# Altium schematic sheet main.SchDoc
size A4; PageSetup: Record=PageOptions|CenterHorizontal=True|CenterVertical=True|PrintScale=0.97|XCorrection=1.00|YCorrection=1.00|PrintKind=0|BorderSize=5000000|LeftOffset=0|BottomOffset=0|Orientation=2|PaperLength=1000|PaperWidth=1000|Scale=100|PaperSource=273|PrintQuality=-2|MediaType=1|DitherType=10|PaperKind=A4|PrintScaleMode=1; Organization: Altium Limited; Address1: 3 Minna Close; Address2: Belrose; Address3: NSW 2085; Address4: Australia
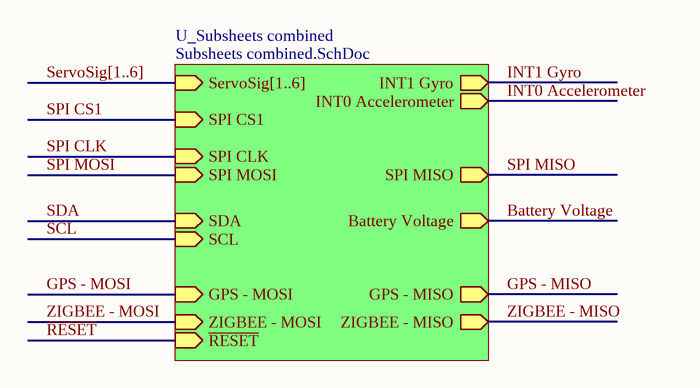
[diagram p0: main.SchDoc]

## Sub-sheets
U_Subsheets combined = Subsheets combined.SchDoc: ServoSig[1..6] (in), INT0 Accelerometer (out), INT1 Gyro (out), ZIGBEE - MISO (out), ZIGBEE - MOSI (in), ~{RESET} (in), SPI CS1 (in), SPI CLK (in), SPI MOSI (in), SPI MISO (out), SDA (in), SCL (in), Battery Voltage (out), GPS - MISO (out), GPS - MOSI (in)

## Nets
Battery Voltage: sheet U_Subsheets combined/Battery Voltage
GPS - MISO: sheet U_Subsheets combined/GPS - MISO
GPS - MOSI: sheet U_Subsheets combined/GPS - MOSI
INT0 Accelerometer: sheet U_Subsheets combined/INT0 Accelerometer
INT1 Gyro: sheet U_Subsheets combined/INT1 Gyro
~{RESET}: sheet U_Subsheets combined/~{RESET}
SCL: sheet U_Subsheets combined/SCL
SDA: sheet U_Subsheets combined/SDA
SPI CLK: sheet U_Subsheets combined/SPI CLK
SPI CS1: sheet U_Subsheets combined/SPI CS1
SPI MISO: sheet U_Subsheets combined/SPI MISO
SPI MOSI: sheet U_Subsheets combined/SPI MOSI
ZIGBEE - MISO: sheet U_Subsheets combined/ZIGBEE - MISO
ZIGBEE - MOSI: sheet U_Subsheets combined/ZIGBEE - MOSI

## Buses and harness runs
bus ServoSig[1..6] = sheet U_Subsheets combined/ServoSig[1..6]

## Notes on the sheet
- Disclaimer
  Any design and information, hardware or software  is provided on an "as-is" basis without warranty of any kind and any express or implied warranties, including, but not limited to, the implied warranties of merchantability and fitness for a particular purpose are disclaimed. In no event shall wnpd (or KeaDrone)be liable for any direct, indirect, incidental, special, exemplary, or consequential damages (including, but not limited to, procurement of substitute goods or services; loss of use, data, or profits; or business interruption) however caused and on any theory of liability, whether in contract, strict liability, or tort (including negligence or otherwise) arising in any way out of the use of this firmware, hardware, software or information, even if wnpd (or KeaDrone) has been advised by user of the possibility of such potential loss or damage. The user agrees to hold wnpd (or KeaDrone) harmless from and against any and all claims, losses, liabilities and expenses.
- Title
- Size:
- Date:
- A4
- Name:
- Time:
- Ing. W. Pietersz
- Revision:
- Sheet
- of
- WillyPietersz@gmail.com
- Contact:
- -
- www.wnpd.nl
- File: